# EAGLE design Grove - Mini Fan v1.0 (EAGLE 6.4)

## Sheet 1 of 2
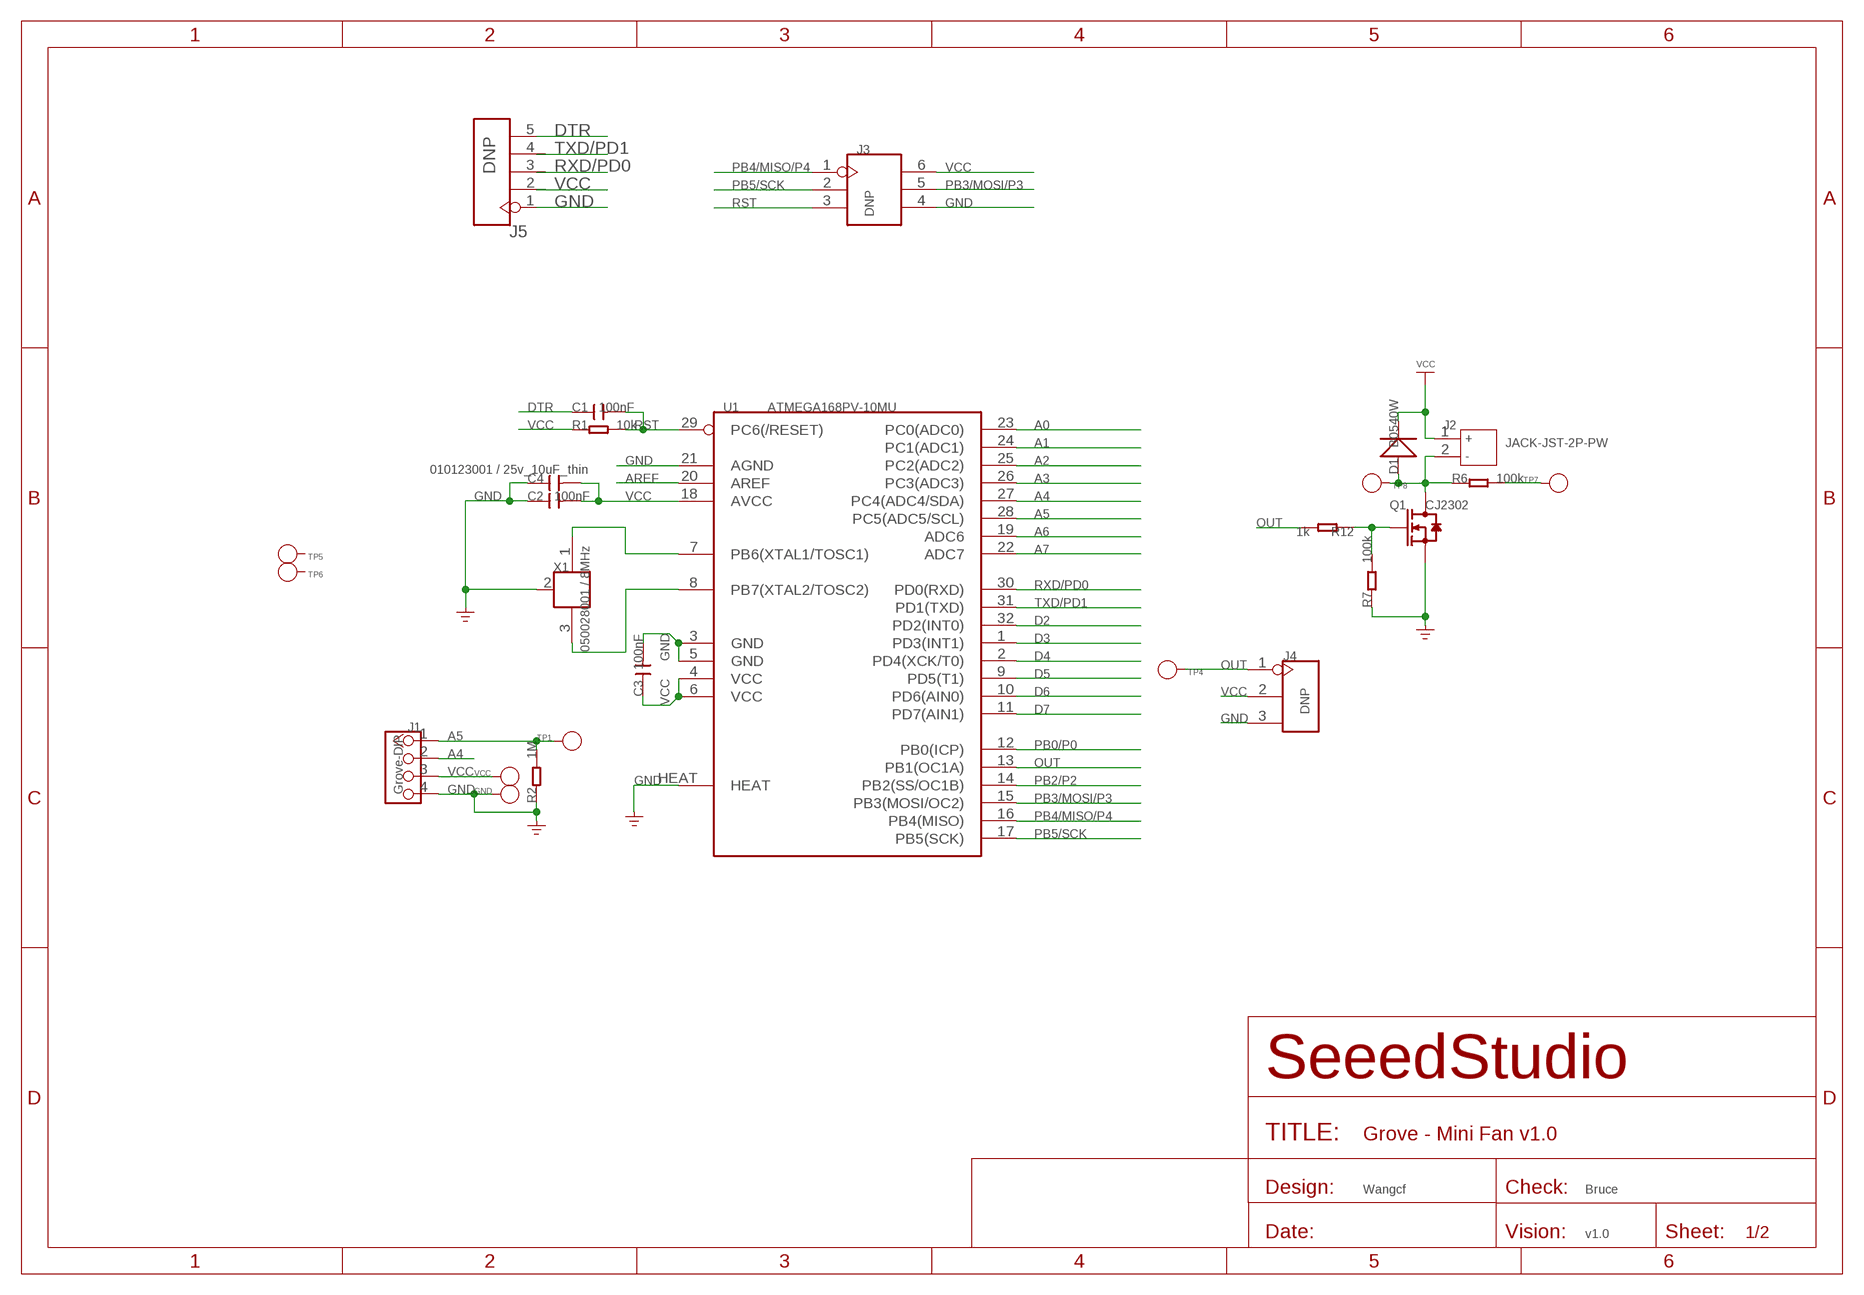
[diagram p0: schematic, sheet 1]

### Parts
C1  100nF  C-0603  [C0603]
C2  100nF  C-0603  [C0603]
C3  100nF  C-0603  [C0603]
C4  010123001 / 25v_10uF_thin  C-0805  [C0805]
D1  B0540W  D'1206'  [SOD123]
GND  PAD-TEST-POINT'4545'  [TP_4545]
J1  Grove-DIP  TWIG-4P-2.0-2.0  [4P-2.0]
J2  JACK-JST-2P-PW  JACK-JST-2P-PW'2.0'  [JST-2.0]
J3  DNP  HEADER-2X3P-2.0  [2X3P-2.0]
J4  DNP  HEADER-3P-2.54  [3P-2.54]
J5  DNP  HEADER-5P-2.54  [5P-2.54]
Q1  CJ2302  MOSFET-N'SOT23'  [SOT23]
R1  10k  R-0603  [R0603]
R2  1M  R-0603  [R0603]
R6  100k  R-0603  [R0603]
R7  100k  R-0603  [R0603]
R12  1k  R-0603  [R0603]
TP1  PAD-TEST-POINT'4545'  [TP_4545]
TP4  PAD-TEST-POINT'4545'  [TP_4545]
TP5  PAD-TEST-POINT'4545'  [TP_4545]
TP6  PAD-TEST-POINT'4545'  [TP_4545]
TP7  PAD-TEST-POINT'4545'  [TP_4545]
TP8  PAD-TEST-POINT'4545'  [TP_4545]
U1  ATMEGA168PV-10MU  MEGA8  [MLF32X]
VCC  PAD-TEST-POINT'4545'  [TP_4545]
X1  050028001 / 8MHz  XTAL_NCVER  [XTAL_3X2]

### Nets
A0: U1.23(PC0(ADC0))
A1: U1.24(PC1(ADC1))
A2: U1.25(PC2(ADC2))
A3: U1.26(PC3(ADC3))
A4: J1.2 U1.27(PC4(ADC4/SDA))
A5: J1.1 R2.2 TP1.T U1.28(PC5(ADC5/SCL))
A6: U1.19(ADC6)
A7: U1.22(ADC7)
AREF: U1.20(AREF)
D2: U1.32(PD2(INT0))
D3: U1.1(PD3(INT1))
D4: U1.2(PD4(XCK/T0))
D5: U1.9(PD5(T1))
D6: U1.10(PD6(AIN0))
D7: U1.11(PD7(AIN1))
DTR: C1.1 J5.5
GND: C2.1 C3.2 C4.1 GND.T J1.4 J3.4 J4.3 J5.1 Q1.2(S) R2.1 R7.1 U1.3(GND) U1.5(GND) U1.21(AGND) U1.HEAT X1.2(GND)
N$1: D1.+ J2.2 Q1.3(D) R6.1 TP8.T
N$3: R6.2 TP7.T
N$9: Q1.1(G) R7.2 R12.1
N$22: U1.7(PB6(XTAL1/TOSC1)) X1.1
N$26: U1.8(PB7(XTAL2/TOSC2)) X1.3
OUT: J4.1 R12.2 TP4.T U1.13(PB1(OC1A))
PB0/P0: U1.12(PB0(ICP))
PB2/P2: U1.14(PB2(SS/OC1B))
PB3/MOSI/P3: J3.5 U1.15(PB3(MOSI/OC2))
PB4/MISO/P4: J3.1 U1.16(PB4(MISO))
PB5/SCK: J3.2 U1.17(PB5(SCK))
RST: C1.2 J3.3 R1.2 U1.29(PC6(/RESET))
RXD/PD0: J5.3 U1.30(PD0(RXD))
TXD/PD1: J5.4 U1.31(PD1(TXD))
VCC: C2.2 C3.1 C4.2 D1.- J1.3 J2.1 J3.6 J4.2 J5.2 R1.1 U1.4(VCC) U1.6(VCC) U1.18(AVCC) VCC.T ; supply symbol labelled POWER_BAR
Unconnected: TP5.T TP6.T

### Notes on the sheet
- Wangcf | Bruce
- v1.0

## Sheet 2 of 2

## Library data of the parts
C1-C4 = Discrete:C*: Ceramic Capacitors
D1 = Discrete:D*
GND TP1 TP4-TP8 VCC = Discrete:PAD-TEST-POINT; PARTNO: DNP
J1 = Connector :TWIG-4P-2.0
J2 = Connector :JACK-JST-2P-PW
J3 = Connector :HEADER-2X3P
J4 = Connector :HEADER-3P
J5 = Connector :HEADER-5P
Q1 = Discrete:MOSFET-N: IRLL014: http://www.vishay.com/docs/91319/sihll014.pdf
R1 R2 R6 R7 R12 = Discrete:R*
U1 = ICs_v54:MEGA8
X1 = CPT_SMD:XTAL_NC

## Net classes
0 default: width 0.152 mm, drill 0.305 mm, clearance 0.152 mm
3 none3: width 0.203 mm, drill 0.305 mm, clearance 0.203 mm

## Board
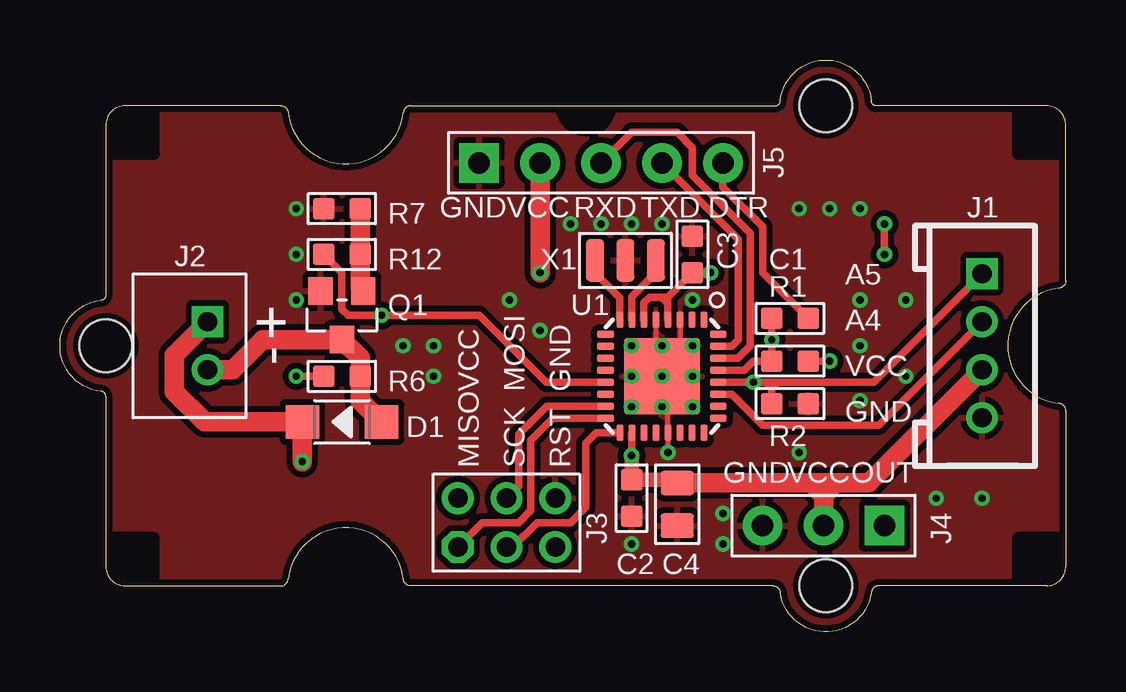
[diagram p1: board, top side]
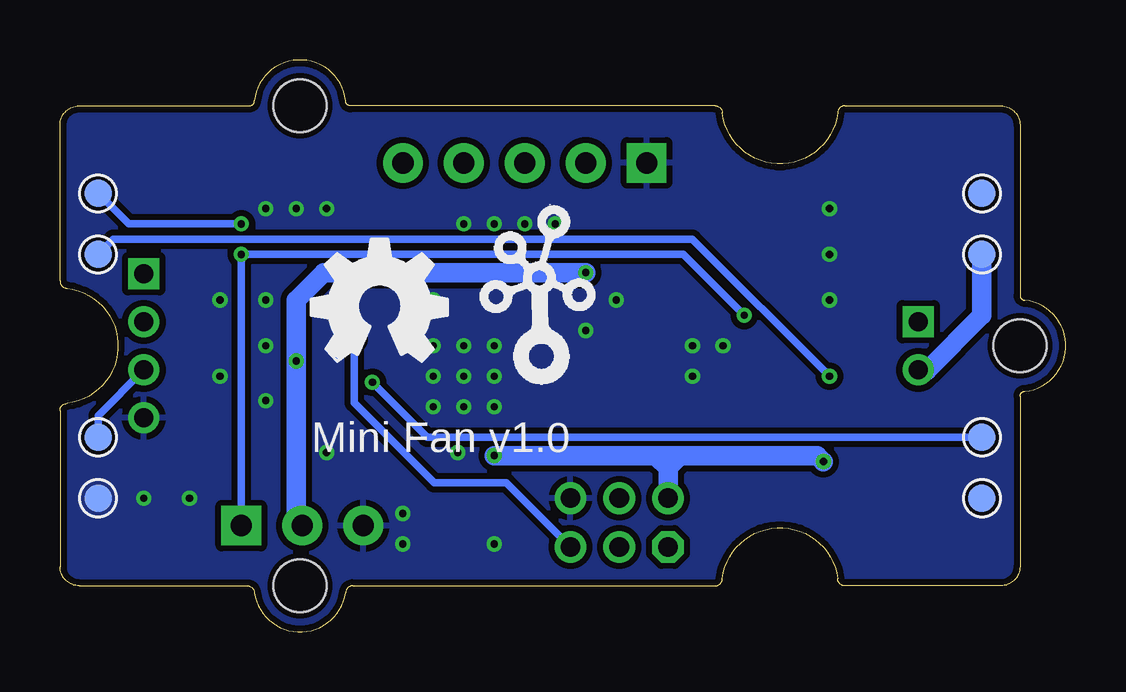
[diagram p2: board, bottom side, seen from below]

Size 41.91 x 23.83 mm. Coordinates in mm from the lower left corner, seen from the top.
Copper layers (1*2+15*16): Top 0.035mm / dielectric 0.2mm / Route2 0.0175mm / dielectric 0.4mm / Route15 0.0175mm / dielectric 0.2mm / Bottom 0.035mm
Design rules "default *": minimum track width 6mil, minimum drill 12mil, track to track 6mil, track to pad 6mil, pad to pad 6mil, via to via 6mil, smd to smd 0mil, copper to edge 10mil, drill to drill 10mil, minimum pad ring 10mil, minimum via ring 6mil, stop-mask expansion 2mil, vias tented up to drill 100mil, thermal gap 10mil

### Footprints (pad centres in the part's own frame; a part is rotated, then mirrored left to right if it is on the bottom)
C0603 = smd 0.889 x 0.889: 1 -0.762,0; 2 0.762,0
C0805 = smd 1.016 x 1.397: 1 -0.889,0; 2 0.889,0
SOD123 = smd 1.397 x 1.397: + -1.651,0; - 1.651,0
TP_4545 = smd 1.143 x 1.143: T 0,0
4P-2.0 = drill 0.8 pad 1.27 square: 1 -3,0 | drill 0.8 pad 1.27: 2 -1,0; 3 1,0; 4 3,0
JST-2.0 = drill 0.8 pad 1.3 square: 1 -1,0.75 | drill 0.8 pad 1.3: 2 1,0.75
2X3P-2.0 = drill 0.813 pad 1.27 octagon: 1 -1.016,2.032 | drill 0.813 pad 1.27: 2 -1.016,0; 3 -1.016,-2.032; 4 1.016,-2.032; 5 1.016,0; 6 1.016,2.032
3P-2.54 = drill 0.889 pad 1.651 square: 1 0,2.54 | drill 0.889 pad 1.651: 2 0,0; 3 0,-2.54
5P-2.54 = drill 0.889 pad 1.651 square: 1 0,5.08 | drill 0.889 pad 1.651: 2 0,2.54; 3 0,0; 4 0,-2.54; 5 0,-5.08
SOT23 = smd 1.016 x 1.143: 1 -0.889,-1.016; 2 0.889,-1.016; 3 0,1.016
R0603 = smd 0.889 x 0.889: 1 -0.762,0; 2 0.762,0
MLF32X = smd 0.7 x 0.3: 1 -2.35,1.75; 2 -2.35,1.25; 3 -2.35,0.75; 4 -2.35,0.25; 5 -2.35,-0.25; 6 -2.35,-0.75; 7 -2.35,-1.25; 8 -2.35,-1.75; 17 2.35,-1.75; 18 2.35,-1.25; 19 2.35,-0.75; 20 2.35,-0.25; 21 2.35,0.25; 22 2.35,0.75; 23 2.35,1.25; 24 2.35,1.75 | smd 0.3 x 0.7: 9 -1.75,-2.35; 10 -1.25,-2.35; 11 -0.75,-2.35; 12 -0.25,-2.35; 13 0.25,-2.35; 14 0.75,-2.35; 15 1.25,-2.35; 16 1.75,-2.35; 25 1.75,2.35; 26 1.25,2.35; 27 0.75,2.35; 28 0.25,2.35; 29 -0.25,2.35; 30 -0.75,2.35; 31 -1.25,2.35; 32 -1.75,2.35 | smd 3.175 x 3.175: HEAT 0,0
GROVE-2CONNECTOR = hole 2.2: -10,-10; -10,10; 20,0
XTAL_3X2 = smd 0.762 x 1.778: 1 -1.27,0; 2 0,0; 3 1.27,0

### Placement (x,y rotation side)
C1  30.42,13.06 180 top
C2  23.81,5.57 90 top
C3  26.35,15.73 90 top
C4  25.72,5.32 90 top
D1  11.75,8.75 180 top
GND  40.32,5.57 180 bottom
J1  38.42,11.92 270 top
J2  5.4,11.92 270 top
J3  18.61,4.56 90 top
J4  31.81,4.43 270 top
J5  22.54,19.54 90 top
Q1  11.75,13.19 180 top
R1  30.42,11.29 180 top
R2  30.42,9.51 180 top
R6  11.75,10.65 180 top
R7  11.75,17.64 0 top
R12  11.75,15.73 180 top
TP1  3.49,8.11 180 bottom
TP4  40.32,18.27 180 bottom
TP5  3.49,18.27 180 bottom
TP6  3.49,5.57 180 bottom
TP7  40.32,15.73 0 bottom
TP8  3.49,15.73 0 bottom
U1  25.08,10.65 270 top
U$2  [GROVE-2CONNECTOR]  21.91,11.92 180 top
U$3  [TWIGLOGO]  21.91,11.29 0 bottom
U$6  [OSHW_FILLX200_NOTEXT]  31.43,11.29 0 bottom
VCC  40.32,8.11 180 bottom
X1  23.56,15.48 180 top

### Tracks (layer width: path | path; a pad name or v marks a point on that pad's centre or on a via)
A4
  Top 0.305: U1.27 27.99,9.9 29.27,8.62 34.12,8.62 J1.2
A5  (via drill 0.3 pad 0.64)
  Top 0.305: J1.1 33.9,10.4 29.66,10.4 | 29.66,10.4 29.4,10.4 | 29.4,10.4 29.28,10.4 | 29.28,10.4 v28.89,10.4 U1.28 | R2.2 29.66,10.14 | 29.66,10.14 29.66,10.4 | 29.4,10.4 29.66,10.14 | 29.66,10.14 29.91,10.4 29.27,10.4 29.28,10.4
  Bottom 0.305: TP1.T 26.6,8.11 v28.89,10.4
DTR
  Top 0.305: J5.5 27.62,18.53 29.27,16.87 29.27,14.97 C1.1
GND  (via drill 0.3 pad 0.64)
  Top 0.203: U1.3 25.85,13.01 25.85,11.41 25.21,10.78 | 25.21,10.78 U1.HEAT | U1.5 24.83,11.16 25.15,10.84 | 25.15,10.84 25.21,10.78 | 25.15,10.84 25.08,10.78 24.96,10.78 25.33,10.4 U1.21 v25.33,7.48 v25.34,7.48
  other vias: 25.08,10.65 23.81,11.92 25.08,11.92 26.35,11.92 26.35,10.65 23.81,10.65 23.81,9.38 25.08,9.38 26.35,9.38 23.81,3.67 27.62,4.94 27.62,3.67 30.8,7.48 26.35,13.83 9.84,13.83 9.84,15.73 9.84,17.64 20,12.56 18.73,13.83 30.8,17.64 32.07,17.64 33.34,17.64 14.29,11.92 15.56,11.92 15.56,10.65 33.34,13.83 33.34,11.92 35.24,13.83 33.34,9.64 36.51,5.57 38.42,5.57 25.08,17 23.81,17 22.54,17 21.27,17 35.24,10.65
  pour Bottom (isolate 0.254): -0.32,23.99 42.23,23.99 42.23,-0.14 -0.32,-0.14
  pour Top (isolate 0.254): -0.32,23.99 42.23,23.99 42.23,-0.14 -0.32,-0.14
N$1
  Top 0.813: J2.2 7.19,10.92 8.45,12.18 Q1.3 12.51,11.41 R6.1 12.51,9.64 D1.+
  Bottom 0.813: TP8.T 3.49,13.19 5.78,10.91 6.13,10.91 J2.2
N$3  (via drill 0.3 pad 0.64)
  Top 0.305: v9.84,10.65 R6.2
  Bottom 0.305: TP7.T 39.69,16.37 15.56,16.37 v9.84,10.65
N$9
  Top 0.813: R7.2 R12.1 12.51,14.33 Q1.1
N$22
  Top 0.305: U1.7 23.83,13.97 24.83,14.97 X1.1
N$26
  Top 0.305: U1.8 23.33,13.93 22.29,14.97 X1.3
OUT  (via drill 0.3 pad 0.64)
  Top 0.305: v34.35,15.73 v34.35,17 | R12.2 11.75,14.97 11.75,13.45 12,13.19 v13.4,13.19 17.46,13.19 20.25,10.4 U1.13
  Bottom 0.305: J4.1 v34.35,15.73 15.94,15.73 v13.4,13.19 | v34.35,17 39.05,17 TP4.T
PB3/MOSI/P3
  Top 0.305: U1.15 20.28,9.4 19.11,8.24 19.11,6.08 J3.5
PB4/MISO/P4
  Top 0.305: U1.16 20.54,8.9 19.62,7.98 19.62,5.06 19.11,4.56 17.59,4.56 J3.1
PB5/SCK
  Top 0.305: J3.2 18.86,3.54 19.88,4.56 21.27,4.56 21.91,5.19 21.91,7.86 22.35,8.3 U1.17
RST  (via drill 0.3 pad 0.64)
  Top 0.305: C1.2 v29.66,12.18 R1.2 28.89,11.29 28.51,10.9 U1.29
  Bottom 0.305: J3.3 23.31,6.21 26.32,6.21 29.66,9.54 v29.66,12.18
RXD/PD0
  Top 0.305: U1.30 28.25,11.4 28.77,11.92 28.77,16.62 26.35,19.03 26.35,20.18 25.72,20.81 23.81,20.81 J5.3
TXD/PD1
  Top 0.305: U1.31 27.98,11.9 28.26,12.18 28.26,16.37 J5.4
VCC  (via drill 0.3 pad 0.64)
  Top 0.305: U1.4 25.33,13.7 | 25.33,13.7 25.33,13.95 | 25.33,13.95 C3.1 | U1.6 24.33,13.71 24.58,13.95 25.08,13.95 | 25.08,13.95 25.33,13.95 | 25.33,13.7 25.08,13.95 | 23.83,6.35 C2.2 | 25.59,6.33 C4.2 | U1.18 23.83,7.37 v23.81,7.35 | R1.1 v32.07,11.29
  Top 0.406: C3.1 v27.12,14.97
  Top 0.61: 25.59,6.33 C2.2 v23.81,7.35
  Top 0.813: C4.2 30.93,6.21 31.31,6.21 | 31.31,6.21 32.07,6.21 | J5.2 v20,14.97 | v10.1,7.1 D1.- 6.03,8.75 4.76,10.02 4.76,11.54 J2.1 | 32.07,6.21 32.32,6.21 | 32.32,6.21 33.7,6.21 J1.3 | J4.2 31.81,5.95 32.07,6.21 | 31.31,6.21 31.69,5.83 31.94,5.83 32.32,6.21 | 32.07,6.21 31.31,6.21
  Bottom 0.305: J1.3 40.32,9.02 VCC.T
  Bottom 0.813: v20,14.97 v27.12,14.97 30.93,14.97 32.07,13.83 v32.07,11.29 32.07,4.68 J4.2 | v23.81,7.35 17.08,7.35 | 17.08,7.35 16.45,7.35 | J3.6 16.57,6.84 | 16.57,6.84 16.57,7.22 16.45,7.35 | 16.45,7.35 16.07,7.35 | 16.07,7.35 10.35,7.35 v10.1,7.1 | 16.57,6.84 16.07,7.35 | 16.57,6.84 17.08,7.35

### Text on the board
tPlace: GND | VCC | RXD | TXD | DTR | A5 | A4 | VCC | VCC | MOSI | GND | GND | MISO | SCK | RST | GND | VCC | OUT
bPlace: Mini Fan v1.0
tNames: - | +